# EAGLE design ProcessingModule (EAGLE 9.1.3)
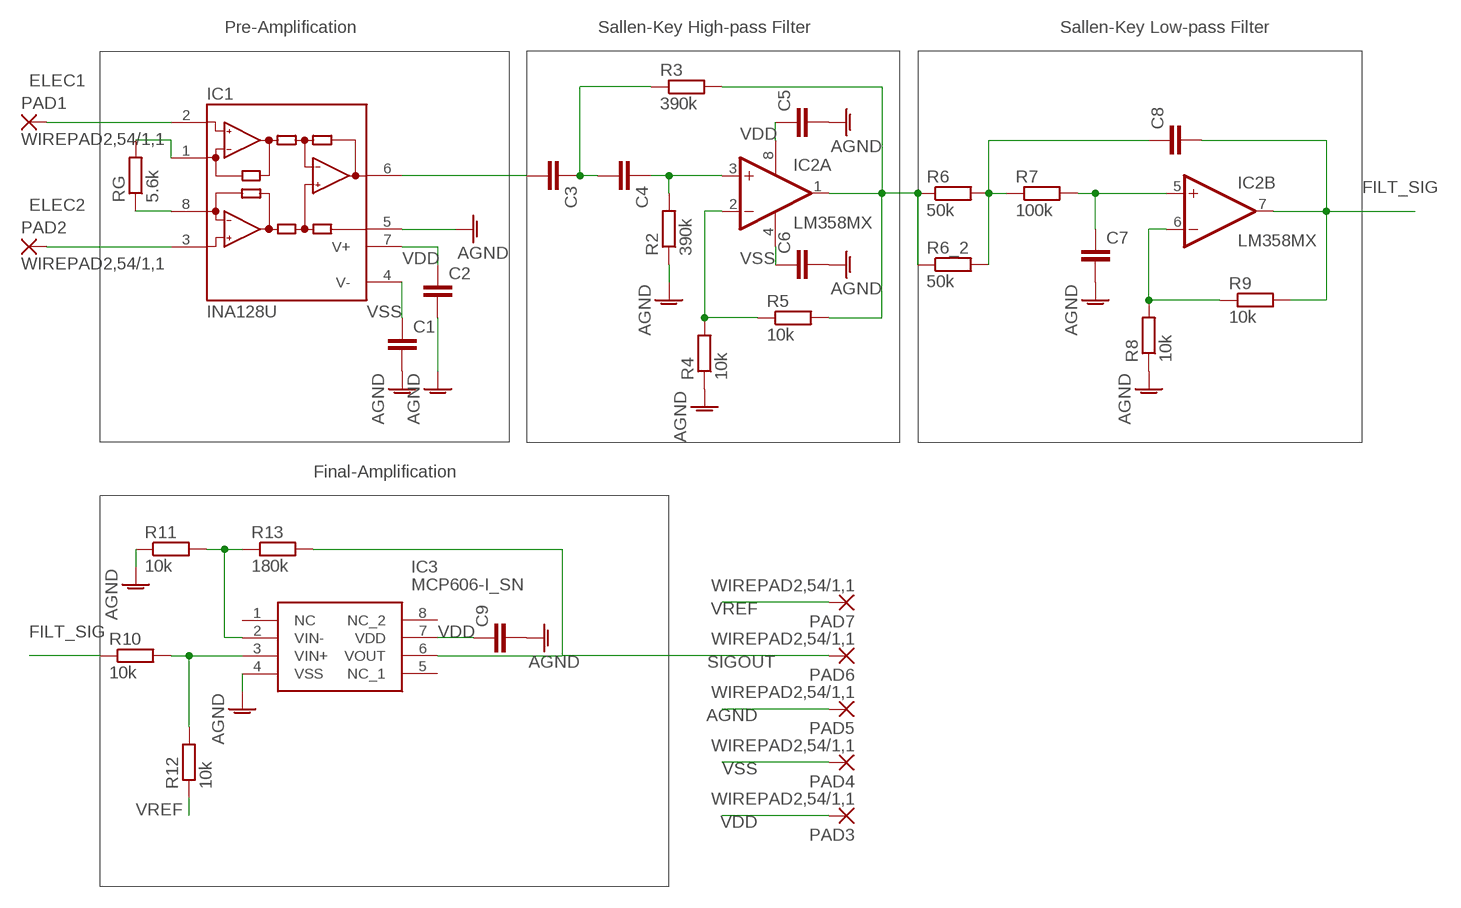
[diagram p0: schematic, sheet 1]

## Parts
C1  C-EUC0603  [C0603]
C2  C-EUC0603  [C0603]
C3  C-EUC0603  [C0603]
C4  C-EUC0603  [C0603]
C5  C-EUC0603  [C0603]
C6  C-EUC0603  [C0603]
C7  C-EUC0603  [C0603]
C8  C-EUC0603  [C0603]
C9  C-EUC0603  [C0603]
IC1  INA128U  [SO08]
IC2  LM358MX  [SO08]
IC3  MCP606-I_SN  [SOIC127P600X175-8N]
PAD1  WIREPAD2,54/1,1  [2,54/1,1]
PAD2  WIREPAD2,54/1,1  [2,54/1,1]
PAD3  WIREPAD2,54/1,1  [2,54/1,1]
PAD4  WIREPAD2,54/1,1  [2,54/1,1]
PAD5  WIREPAD2,54/1,1  [2,54/1,1]
PAD6  WIREPAD2,54/1,1  [2,54/1,1]
PAD7  WIREPAD2,54/1,1  [2,54/1,1]
R2  390k  R-EU_R0805  [R0805]
R3  390k  R-EU_R0805  [R0805]
R4  10k  R-EU_R0805  [R0805]
R5  10k  R-EU_R0805  [R0805]
R6  50k  R-EU_R0805  [R0805]
R6_2  50k  R-EU_R0805  [R0805]
R7  100k  R-EU_R0805  [R0805]
R8  10k  R-EU_R0805  [R0805]
R9  10k  R-EU_R0805  [R0805]
R10  10k  R-EU_R0805  [R0805]
R11  10k  R-EU_R0805  [R0805]
R12  10k  R-EU_R0805  [R0805]
R13  180k  R-EU_R0805  [R0805]
RG  5.6k  R-EU_R0805  [R0805]

## Nets
AGND: C1.2 C2.2 C5.2 C6.2 C7.2 C9.2 IC1.5(REF) IC3.4(VSS) PAD5.1(P) R2.1 R4.1 R8.1 R11.1
ELEC1: IC1.2(-IN) PAD1.1(P)
ELEC2: IC1.3(+IN) PAD2.1(P)
FILT_SIG: C8.2 IC2.7(B:OUT) R9.2 R10.1
N$1: IC1.1(RG) RG.2
N$2: IC1.8(RG) RG.1
N$3: IC2.2(A:-IN) R4.2 R5.1
N$4: IC2.1(A:OUT) R3.2 R5.2 R6.1 R6_2.1
N$5: C4.1 IC2.3(A:+IN) R2.2
N$6: C3.1 C4.2 R3.1
N$7: C3.2 IC1.6(OUT)
N$9: C7.1 IC2.5(B:+IN) R7.2
N$11: C8.1 R6.2 R6_2.2 R7.1
N$12: IC3.3(VIN+) R10.2 R12.2
N$13: IC3.2(VIN-) R11.2 R13.1
N$14: IC2.6(B:-IN) R8.2 R9.1
SIGOUT: IC3.6(VOUT) PAD6.1(P) R13.2
VDD: C2.1 C5.1 C9.1 IC1.7(V+) IC2.8(P:V+) IC3.7(VDD) PAD3.1(P)
VREF: PAD7.1(P) R12.1
VSS: C1.1 C6.1 IC1.4(V-) IC2.4(P:V-) PAD4.1(P)
Unconnected: IC3.1(NC) IC3.5(NC_1) IC3.8(NC_2)

## Notes on the sheet
- Pre-Amplification | Sallen-Key High-pass Filter | Sallen-Key Low-pass Filter
- Final-Amplification

## Library data of the parts
C1-C9 = rcl:C-EU: CAPACITOR, European symbol; SPICEPREFIX: C
IC1 = burr-brown:INA128: Instrumentation Amplifiers Precision, Low Power; MF: TEXAS INSTRUMENTS; MPN: INA128U; OC_FARNELL: 1212413; OC_NEWARK: 35C1729
IC2 = linear:LM358: OP AMP also LM158; LM258; LM2904 Source: http://cache.national.com/ds/LM/LM158.pdf; SPICEPREFIX: J
IC3 = MCP606-I_SN:MCP606-I_SN: Single 25uA,2.5V Op Amp,MCP606-I/SN Source: Datasheet <http://ww1.microchip.com/downloads/en/DeviceDoc/11177f.pdf>; ALLIED_NUMBER: 70046173; ALLIED_PRICE-STOCK: http://www.alliedelec.com/microchip-technology-inc-mcp606-i-sn/70046173/; ARROW_PART_NUMBER: MCP606-I/SN; ARROW_PRICE-STOCK: https://www.arrow.com/en/products/mcp606-isn/microchip-technology; DESCRIPTION: Single 25uA,2.5V Op Amp,MCP606-I/SN; HEIGHT: 1.75mm; MANUFACTURER_NAME: Microchip; MANUFACTURER_PART_NUMBER: MCP606-I/SN; RS_PART_NUMBER: 0403002P; RS_PRICE-STOCK: http://uk.rs-online.com/web/p/products/0403002P
PAD1-PAD7 = wirepad:WIREPAD: Wire PAD connect wire on PCB
R2-R6 R6_2 R7-R13 RG = rcl:R-EU_: RESISTOR, European symbol; SPICEPREFIX: R

## Net classes
0 default: width 0.406 mm, drill 0.559 mm, clearance 0.254 mm

## Board
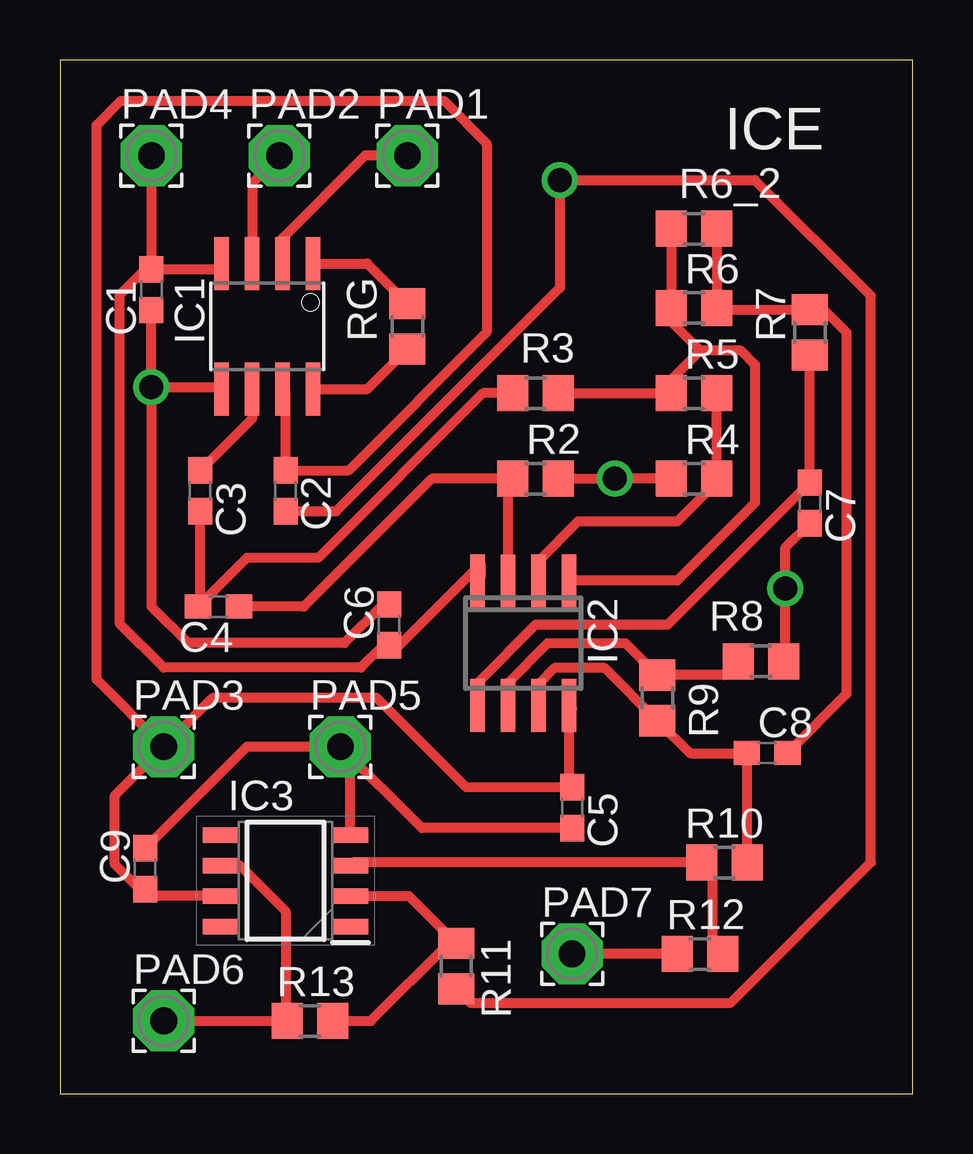
[diagram p1: board, top side]
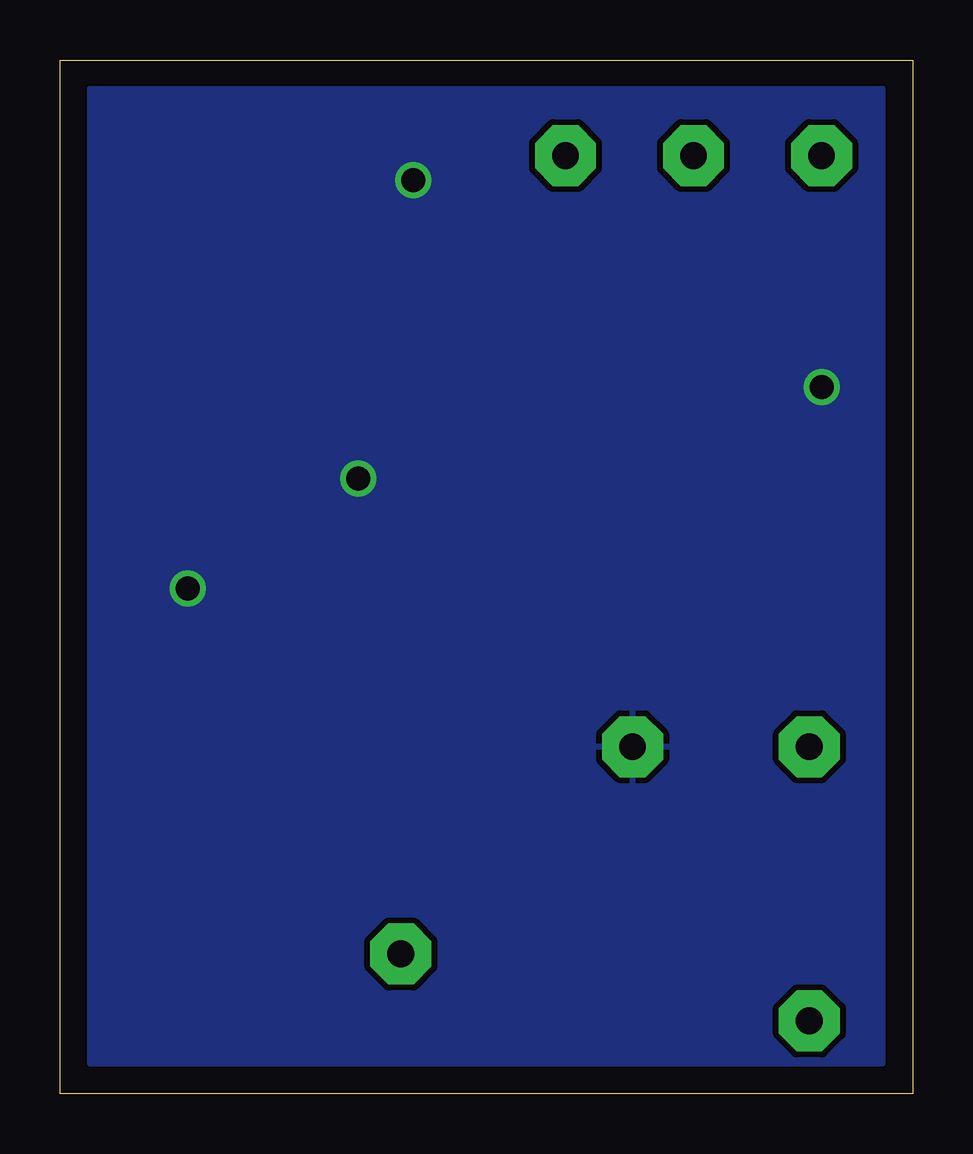
[diagram p2: board, bottom side, seen from below]

Size 35.54 x 43.1 mm. Coordinates in mm from the lower left corner, seen from the top.
Outline: 0,0 35.54,0 35.54,43.1 0,43.1 0,0
Copper layers (1*16): Top 0.035mm / dielectric 1.5mm / Bottom 0.035mm
Design rules "default": minimum track width 6mil, minimum drill 0.35mm, track to track 6mil, track to pad 6mil, pad to pad 6mil, via to via 6mil, smd to smd 6mil, copper to edge 40mil, drill to drill 6mil, minimum pad ring 10mil, minimum via ring 8mil, stop-mask expansion 4mil, vias tented up to drill 0mil, thermal gap 10mil

### Footprints (pad centres in the part's own frame; a part is rotated, then mirrored left to right if it is on the bottom)
C0603 = smd 1.1 x 1: 1 -0.85,0; 2 0.85,0
SO08 = smd 0.61 x 2.21: 1 -1.905,-2.616; 2 -0.635,-2.616; 3 0.635,-2.616; 4 1.905,-2.616; 5 1.905,2.616; 6 0.635,2.616; 7 -0.635,2.616; 8 -1.905,2.616
SO08' = smd 0.6 x 2.2: 1 -1.905,-2.6; 2 -0.635,-2.6; 3 0.635,-2.6; 4 1.905,-2.6; 5 1.905,2.6; 6 0.635,2.6; 7 -0.635,2.6; 8 -1.905,2.6
SOIC127P600X175-8N = smd 1.5 x 0.65: 1 -2.7,1.905; 2 -2.7,0.635; 3 -2.7,-0.635; 4 -2.7,-1.905; 5 2.7,-1.905; 6 2.7,-0.635; 7 2.7,0.635; 8 2.7,1.905
2,54/1,1 = drill 1.118 pad 2.54 octagon: 1 0,0
R0805 = smd 1.3 x 1.5: 1 -0.95,0; 2 0.95,0

### Placement (x,y rotation side)
C1  3.81,33.53 270 top
C2  9.4,25.15 270 top
C3  5.84,25.15 90 top
C4  6.6,20.32 180 top
C5  21.34,11.94 270 top
C6  13.72,19.56 90 top
C7  31.24,24.64 270 top
C8  29.46,14.22 180 top
C9  3.56,9.4 90 top
IC1  8.64,32 180 top
IC2  LM358MX  [SO08']  19.3,18.8 180 top
IC3  9.4,8.89 180 top
PAD1  14.48,39.12 0 top
PAD2  9.14,39.12 0 top
PAD3  4.32,14.48 0 top
PAD4  3.81,39.12 0 top
PAD5  11.68,14.48 0 top
PAD6  4.32,3.05 0 top
PAD7  21.34,5.84 0 top
R2  19.81,25.65 180 top
R3  19.81,29.21 0 top
R4  26.42,25.65 0 top
R5  26.42,29.21 180 top
R6  26.42,32.77 0 top
R6_2  26.42,36.07 0 top
R7  31.24,31.75 270 top
R8  29.21,18.03 180 top
R9  24.89,16.51 270 top
R10  27.69,9.65 180 top
R11  16.51,5.33 90 top
R12  26.67,5.84 0 top
R13  10.41,3.05 180 top
RG  14.48,32 90 top

### Tracks (layer width: path | path; a pad name or v marks a point on that pad's centre or on a via)
AGND  (via drill 1)
  Top 0.406: 3.83,32.38 C1.2 v3.81,29.46 | 9.65,24.04 C2.2 | v3.81,29.46 6.66,29.46 IC1.5 | C2.2 9.65,24.55 | C2.2 11.51,24.3 20.79,33.57 20.83,33.61 v20.83,38.1 28.96,38.1 33.78,33.27 33.78,9.65 27.94,3.81 17.08,3.81 R11.1 | R4.1 v23.11,25.65 R2.1 | v3.81,29.46 3.81,20.32 5.33,18.8 11.85,18.8 13.46,20.41 C6.2 | IC3.4 12.1,14.06 PAD5.1 | PAD5.1 7.79,14.48 C9.2 | C5.2 15.07,11.09 PAD5.1 | R8.1 30.23,18.1 v30.23,21.08 30.23,22.77 C7.2
  pour Bottom: 1.27,1.27 34.29,1.27 34.29,41.91 1.27,41.91
ELEC1
  Top 0.406: 9.37,34.91 9.37,34.82 IC1.2 9.27,35.69 12.7,39.12 PAD1.1
ELEC2
  Top 0.406: PAD2.1 8,37.97 IC1.3
FILT_SIG
  Top 0.406: 28.26,14.22 C8.2 28.64,14.2 | IC2.7 19.94,17.09 20.6,17.75 22.7,17.75 R9.2 26.25,14.2 28.64,14.2 | R10.1 28.64,14.2
N$1
  Top 0.406: IC1.1 12.81,34.62 RG.2
N$2
  Top 0.406: IC1.8 12.81,29.39 RG.1
N$3
  Top 0.406: R5.1 R4.2 27.37,25.51 25.73,23.88 21.59,23.88 19.94,22.23 IC2.2
N$4
  Top 0.406: R3.2 R5.2 25.47,29.78 26.67,30.99 | 25.91,32.77 R6.1 | 26.67,30.99 28.38,30.99 28.96,30.41 28.96,24.64 25.71,21.4 IC2.1 | 26.67,30.99 25.47,32.19 R6.1 | R6_2.1 R6.1
N$5
  Top 0.406: C4.1 10.16,20.32 15.49,25.65 R2.2 18.67,25.46 IC2.3
N$6
  Top 0.406: 5.75,24.21 C3.1 5.84,20.41 C4.2 7.79,22.35 10.76,22.35 17.62,29.21 R3.1
N$7
  Top 0.406: IC1.6 8,28.16 C3.2
N$9
  Top 0.406: IC2.5 17.4,17.14 19.81,19.56 25.31,19.56 C7.1 R7.2
N$11
  Top 0.406: R6.2 27.43,32.7 | 27.43,32.7 R7.1 31.82,32.7 32.77,31.75 32.77,16.68 C8.1 | R6_2.2 R6.2 | R6.2 27.43,32.7
N$12
  Top 0.406: 26.61,9.53 R10.2 | 26.6,9.52 R10.2 | R10.2 12.22,9.65 IC3.3 | R10.2 27.18,9.21 27.18,6.28 R12.2
N$13
  Top 0.406: IC3.2 14.54,8.26 R11.2 16.19,6.28 12.95,3.05 R13.1
N$14
  Top 0.406: IC2.6 18.67,17.14 20.32,18.8 23.56,18.8 R9.1 27.69,17.46 R8.2
SIGOUT
  Top 0.406: IC3.6 7.49,9.53 9.4,7.62 9.4,3.11 R13.2 PAD6.1
VDD
  Top 0.406: 3.52,8.51 C9.1 | C2.1 9.53,25.95 | 21.38,12.83 C5.1 | C2.1 9.4,29.26 IC1.7 | C2.1 12.03,26 17.78,31.75 17.78,39.62 16,41.4 2.54,41.4 1.52,40.39 1.52,17.27 PAD3.1 | 21.34,16.07 IC2.8 21.21,12.91 C5.1 | IC3.7 3.85,8.26 C9.1 | C5.1 16.93,12.79 13.21,16.51 6.35,16.51 PAD3.1 | PAD3.1 2.29,12.45 2.29,9.56 3.3,8.55 C9.1
VREF
  Top 0.406: R12.1 PAD7.1
VSS
  Top 0.406: IC1.4 6.73,34.49 6.62,34.38 C1.1 | C1.1 3.56,34.38 2.5,33.32 2.5,19.6 4.32,17.78 12.53,17.78 13.46,18.71 C6.1 14.14,18.71 17.53,22.1 17.53,21.52 IC2.4 17.34,21.34 | PAD4.1 C1.1

### Text on the board
tNames: ICE